# Altium schematic sheet main.SchDoc
size 241 x 88 mm
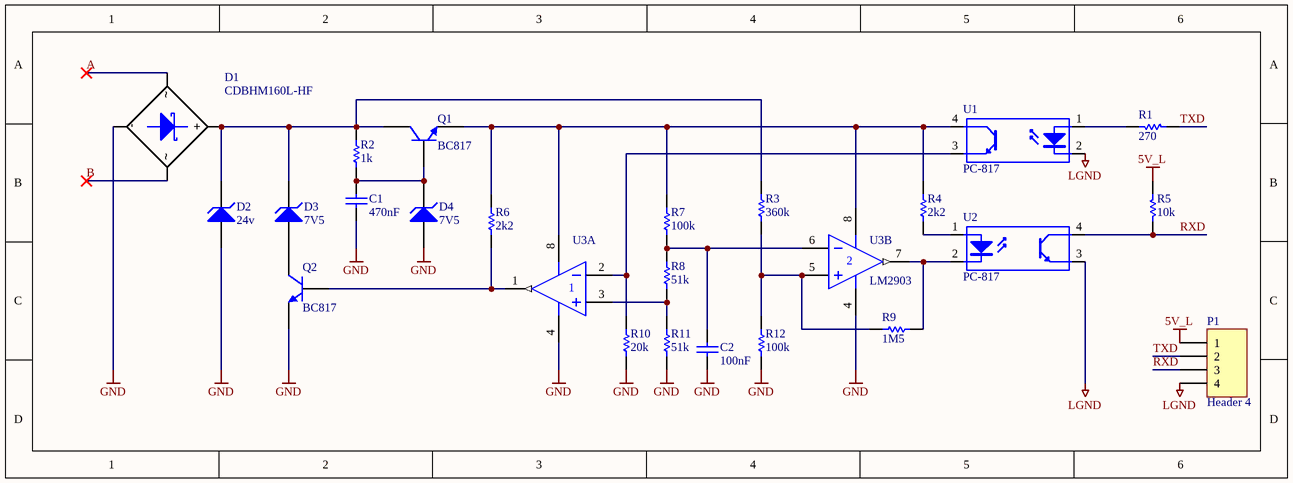
[diagram p0: main.SchDoc]

## Parts
C1  470nF  [RC_0805_T0.8]
C2  100nF  [RC_0805_T0.8]
D1  CDBHM160L-HF  [RR_MBS]
D2  24v  [RR_SOT-23]
D3  7V5  [RR_SOT-23]
D4  7V5  [RR_SOT-23]
P1  Header 4  [HDR1X4]
Q1  BC817  [SOT-23B_L]
Q2  BC817  [SOT-23B_L]
R1  270  [RR_0805]
R2  1k  [RR_0805]
R3  360k  [RR_0805]
R4  2k2  [RR_0805]
R5  10k  [RR_0805]
R6  2k2  [RR_0805]
R7  100k  [RR_0805]
R8  51k  [RR_0805]
R9  1M5  [RR_0805]
R10  20k  [RR_0805]
R11  51k  [RR_0805]
R12  100k  [RR_0805]
U1  PC-817  [RR_DIP_SM4]
U2  PC-817  [RR_DIP_SM4]
U3  LM2903  [RR_SO-8]  (value not drawn)  (parts A,B of 2)

## Nets
5V_L: P1.1 R5.1
GND: C1.1 C2.1 D1.2(A) D2.1(A) D4.1(A) Q2.2(E) R10.2 R11.2 R12.2 U3.4(V-)
LGND: P1.4 U1.2(K) U2.3(E)
A: D1.3(K)
B: D1.4(K)
RXD: P1.3 R5.2 U2.4(C)
TXD: P1.2 R1.1
NetC1_2: C1.2 D4.3(A) Q1.1(B) R2.1
NetC2_2: C2.2 R7.2 R8.1 U3.6(IN-)
NetD1_1: D1.1(K) D2.3(A) D3.3(A) Q1.3(C) R2.2 R3.2
NetD3_1: D3.1(A) Q2.3(C)
NetQ1_2: Q1.2(E) R4.1 R6.1 R7.1 U1.4(C) U3.8(V+)
NetQ2_1: Q2.1(B) R6.2 U3.1(OUT)
NetR1_2: R1.2 U1.1(A)
NetR3_1: R3.1 R9.1 R12.1 U3.5(IN+)
NetR4_2: R4.2 U2.1(A)
NetR8_2: R8.2 R11.1 U3.3(IN+)
NetR9_2: R9.2 U2.2(K) U3.7(OUT)
NetR10_1: R10.1 U1.3(E) U3.2(IN-)

## Notes on the sheet
- (in symbol CDBHM160L-HF) ~; -; +

## Library data of the parts
C1 = Cap: 470nF 0805
C2 = Cap: 100nF 0805
D2 = BZX84: Zener 24v SOT-23
D3 D4 = BZX84: Zener 7V5 SOT-23
P1 = Header 4: Header, 4-Pin
Q1 Q2 = NPN_SOT23
R1 = Res1: 270 0805
R2 = Res1: 1k 0805
R3 = Res1: 360k 0805
R4 R6 = Res1: 2k2 0805
R5 = Res1: 10k 0805
R7 R12 = Res1: 100k 0805
R8 R11 = Res1: 51k 0805
R9 = Res1: 1M5 0805
R10 = Res1: 20k 0805
U1 U2 = Optoisolator1
U3 = LM393ADR